# Altium schematic sheet 02config.SchDoc
size 381 x 241 mm
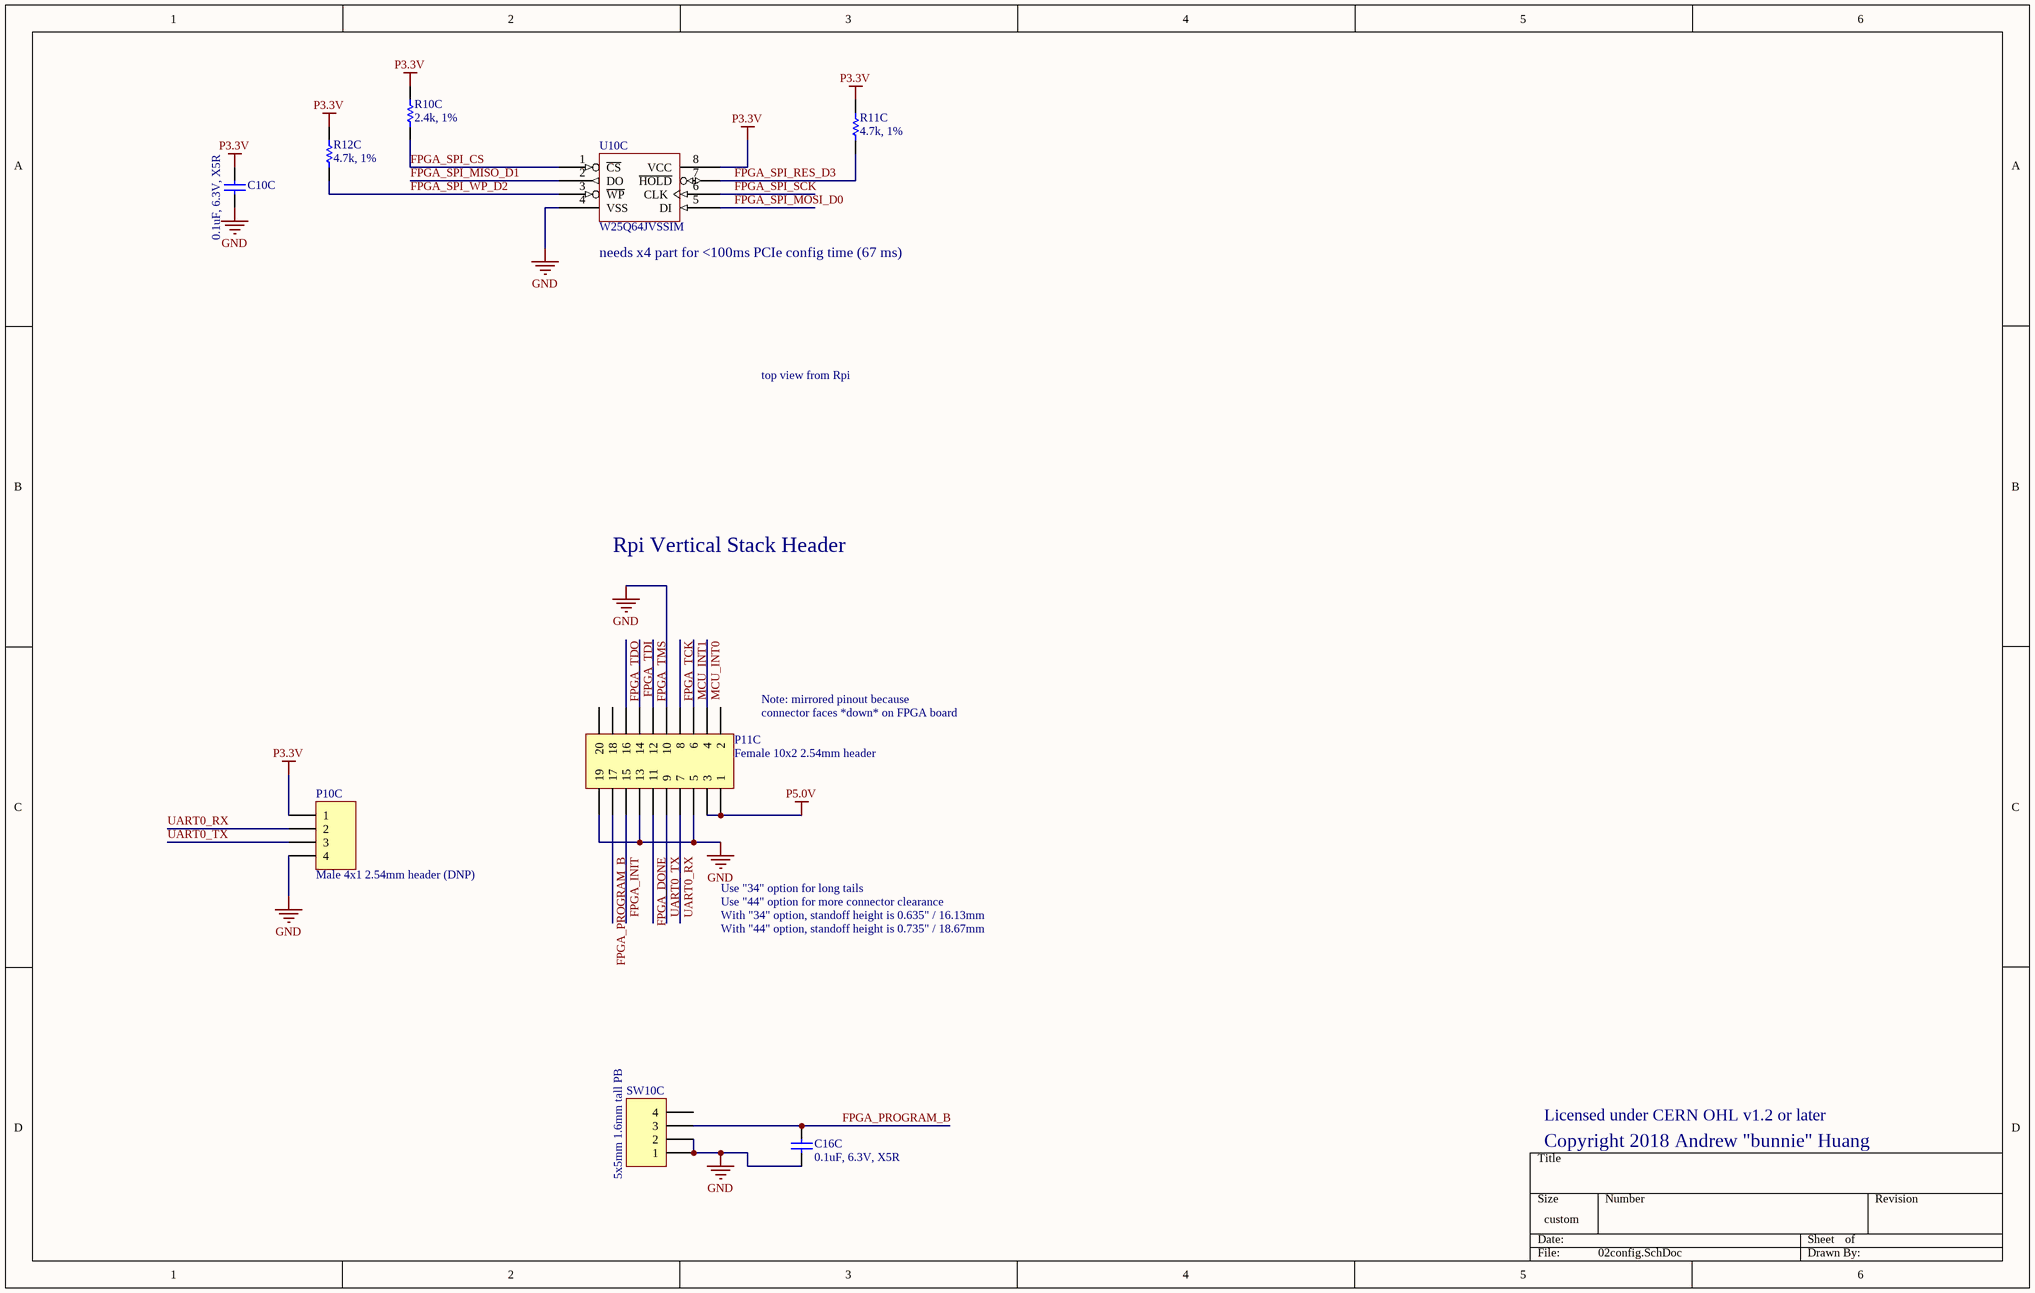
[diagram p0: 02config.SchDoc]

## Parts
C10C  0.1uF, 6.3V, X5R  [CAPC0603X03L]
C16C  0.1uF, 6.3V, X5R  [CAPC0603X03L]
P10C  Male 4x1 2.54mm header (DNP)  [HDR1X4]
P11C  Female 10x2 2.54mm header  [HDR2X10]
R10C  2.4k, 1%  [CAPC0603X03L]
R11C  4.7k, 1%  [RESC1005N]
R12C  4.7k, 1%  [RESC1005N]
SW10C  5x5mm 1.6mm tall PB  [SWITCH_TS-1187A]
U10C  W25Q64JVSSIM  [SOIC127P790X216-8N]

## Nets
GND: C10C.2 C16C.2 P10C.4 P11C.5 P11C.10 P11C.13 P11C.19 SW10C.1 SW10C.2 U10C.4(VSS)
P3.3V: C10C.1 P10C.1 R10C.1 R11C.1 R12C.1 U10C.8(VCC)
P5.0V: P11C.1 P11C.3
FPGA_DONE: P11C.11
FPGA_INIT: P11C.15
FPGA_PROGRAM_B: C16C.1 P11C.17 SW10C.3
FPGA_SPI_CS: R10C.2 U10C.1(~{CS})
FPGA_SPI_MISO_D1: U10C.2(DO)
FPGA_SPI_MOSI_D0: U10C.5(DI)
FPGA_SPI_RES_D3: R11C.2 U10C.7(~{HOLD})
FPGA_SPI_SCK: U10C.6(CLK)
FPGA_SPI_WP_D2: R12C.2 U10C.3(~{WP})
FPGA_TCK: P11C.8
FPGA_TDI: P11C.14
FPGA_TDO: P11C.16
FPGA_TMS: P11C.12
MCU_INT0: P11C.4
MCU_INT1: P11C.6
UART0_RX: P10C.2 P11C.7
UART0_TX: P10C.3 P11C.9

Not connected (* = marked no-connect by the designer): P11C 2 18 20; SW10C 4

## Notes on the sheet
- (near U10C) needs x4 part for <100ms PCIe config time (67 ms)
- top view from Rpi
- Rpi Vertical Stack Header
- (near P11C) Note: mirrored pinout because
- (near P11C) connector faces *down* on FPGA board
- Use "34" option for long tails
- Use "44" option for more connector clearance
- With "44" option, standoff height is 0.735" / 18.67mm
- With "34" option, standoff height is 0.635" / 16.13mm
- Licensed under CERN OHL v1.2 or later
- Copyright 2018 Andrew "bunnie" Huang

## Library data of the parts
C10C C16C = Cap Semi: Capacitor (Semiconductor SIM Model); MPN: CL03A104KQ3NNNC; VENDOR: Samsung; MYPN: C-104-6p3-X5R-0201
P10C = Header 4: Header, 4-Pin; MYPN: J-HDR-2.54-4x1-STD-DNP; LatestRevisionDate: 17-Jul-2002; LatestRevisionNote: Re-released for DXP Platform.; Publisher: Altium Limited; MPN: DNP; VENDOR: DNP
P11C = Header 10X2: Header, 10-Pin, Dual row; MPN: F201-SGP-D048-20-P4; VENDOR: KAWAEEI; MYPN: ESW-110-44-L-D; LatestRevisionDate: 17-Jul-2002; LatestRevisionNote: Re-released for DXP Platform.; Publisher: Altium Limited
R10C = Res1: Resistor; VENDOR: ANY; MYPN: R-242-1P-1_16W-0201; MPN: ANY
R11C R12C = Res1: Resistor; MPN: RS02U472FT; VENDOR: Fenghua; MYPN: R-472-1P-1_16W-0402
SW10C = Header 4: Chi Fung TS-1187A; MPN: SW-PB-5X5-1.6; VENDOR: Kangdeli; LatestRevisionDate: 17-Jul-2002; LatestRevisionNote: Re-released for DXP Platform.; Publisher: Altium Limited; MYPN: SW-PB-5X5-1.6
U10C = EN25P05-50GCP: 64Mbit SPI NOR FLASH; MYPN: UW25Q64JVSSIM; VENDOR: Winbond; MPN: W25Q64JVSSIM